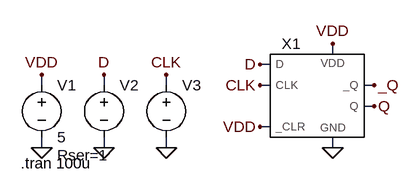
[diagram p0: schematic FFDTB.asc]
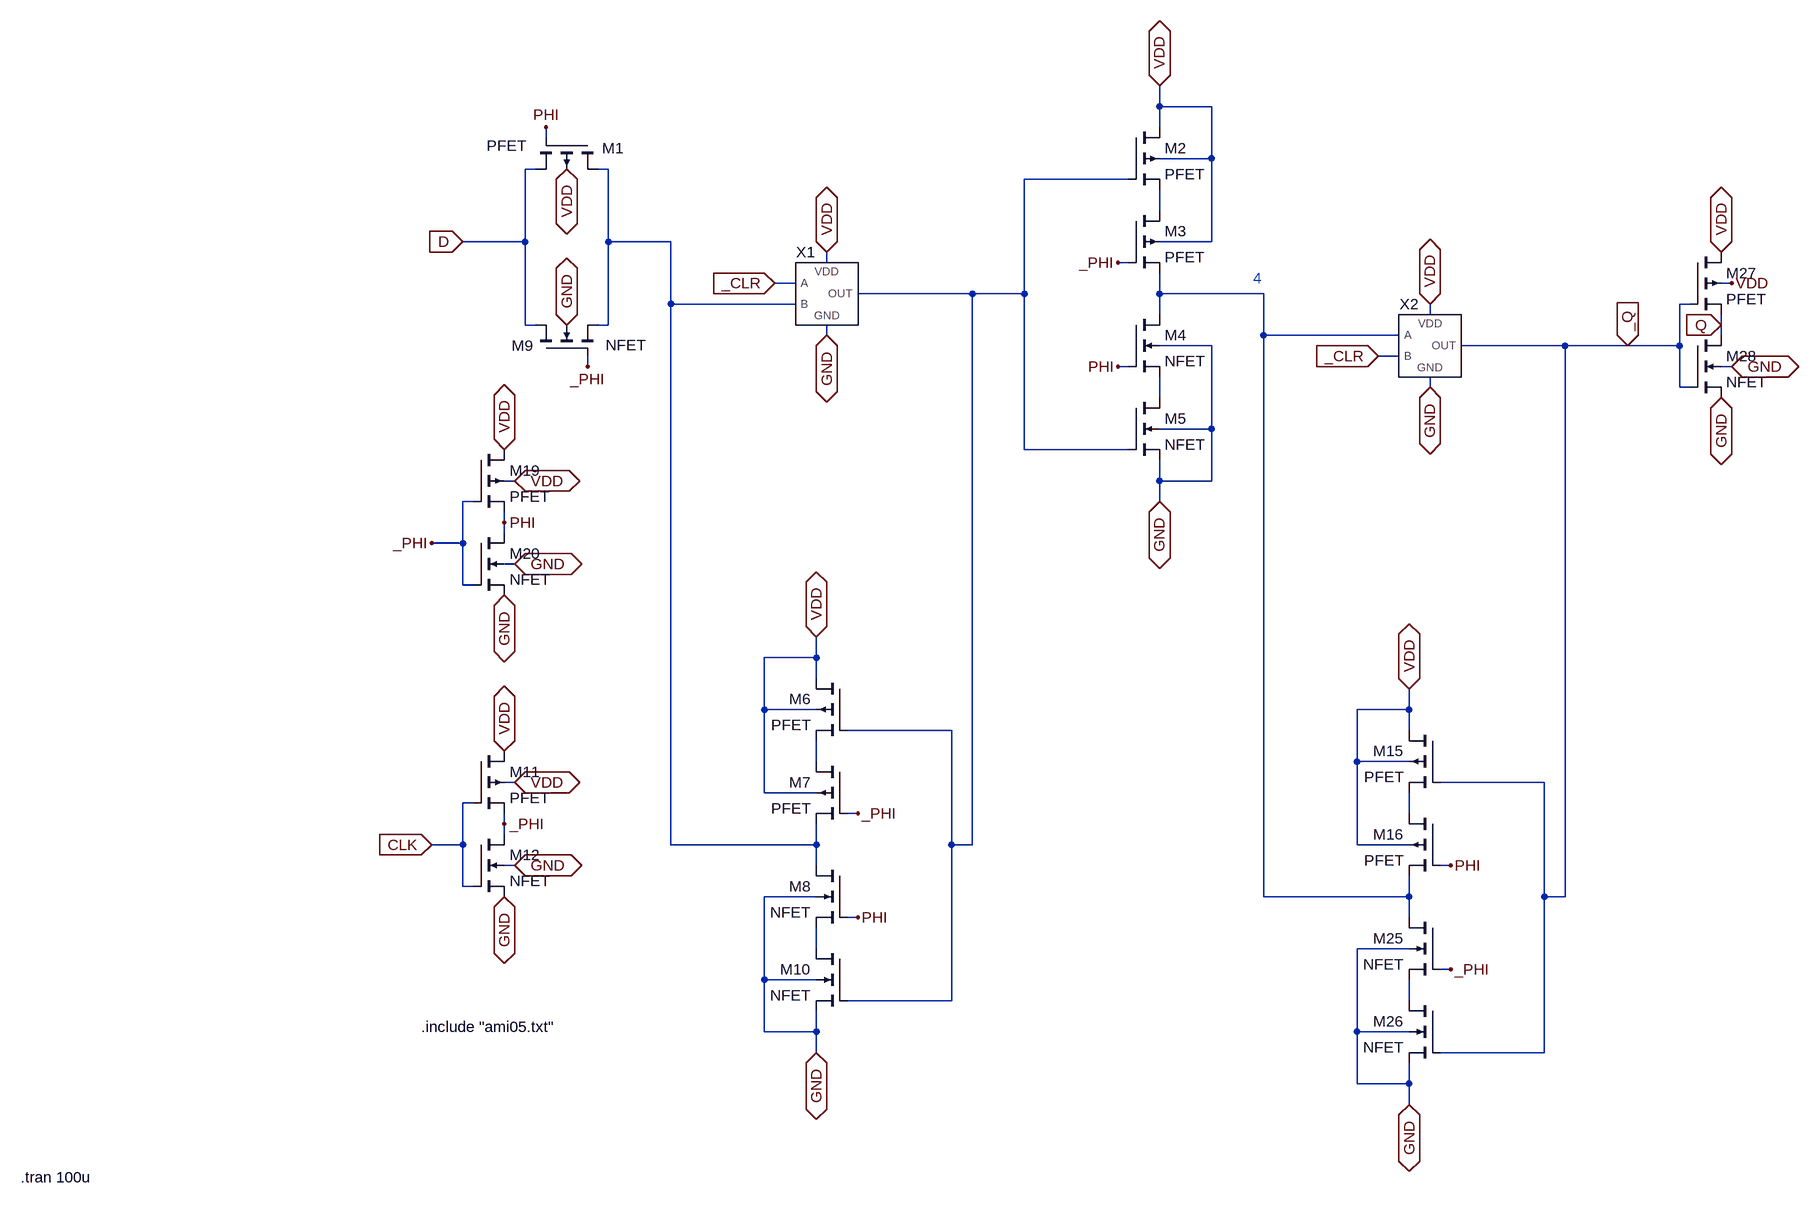
[diagram p1: sub-circuit ffd.asc]
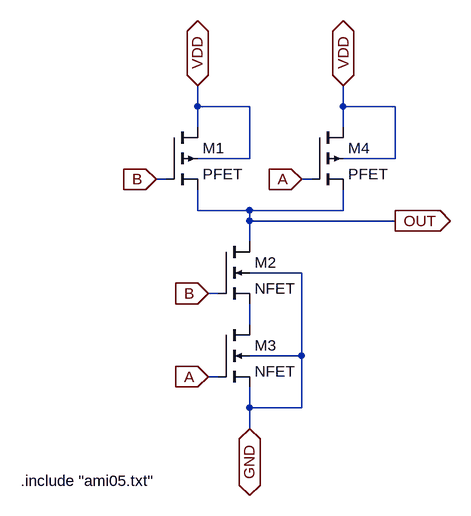
[diagram p2: sub-circuit nand.asc]
FFDTB.asc, the LTspice schematic file:
Version 4
SHEET 1 880 680
WIRE 224 64 224 48
WIRE 128 80 112 80
WIRE -224 112 -224 96
WIRE -128 112 -128 96
WIRE -32 112 -32 96
WIRE 128 112 112 112
WIRE 288 112 272 112
WIRE 288 144 272 144
WIRE 128 176 112 176
WIRE -224 208 -224 192
WIRE -128 208 -128 192
WIRE -32 208 -32 192
WIRE 224 208 224 192
FLAG 224 48 VDD
FLAG 224 208 0
FLAG 288 112 _Q
FLAG 112 80 D
FLAG 112 112 CLK
FLAG -224 208 0
FLAG -128 208 0
FLAG -32 208 0
FLAG -128 96 D
FLAG -32 96 CLK
FLAG -224 96 VDD
FLAG 288 144 Q
FLAG 112 176 VDD
SYMBOL voltage -224 96 R0
WINDOW 123 0 0 Left 0
WINDOW 39 24 124 Left 2
SYMATTR SpiceLine Rser=1
SYMATTR InstName V1
SYMATTR Value 5
SYMBOL voltage -128 96 R0
WINDOW 3 24 96 Invisible 2
WINDOW 123 0 0 Left 0
WINDOW 39 0 0 Left 0
SYMATTR Value PULSE(0 5 3u 1n 1n 10u 20u)
SYMATTR InstName V2
SYMBOL voltage -32 96 R0
WINDOW 3 24 96 Invisible 2
WINDOW 123 0 0 Left 0
WINDOW 39 0 0 Left 0
SYMATTR Value PULSE(0 5 0 1n 1n 5u 10u)
SYMATTR InstName V3
SYMBOL FFD 208 144 R0
SYMATTR InstName X1
TEXT -256 232 Left 2 !.tran 100u

ffd.asc, the sub-circuit schematic file:
Version 4
SHEET 1 2988 1332
WIRE 992 -336 992 -368
WIRE 1072 -336 992 -336
WIRE 992 -304 992 -336
WIRE 48 -288 48 -304
WIRE 1072 -256 1072 -336
WIRE 1072 -256 992 -256
WIRE 32 -240 16 -240
WIRE 144 -240 128 -240
WIRE 944 -224 784 -224
WIRE 992 -176 992 -208
WIRE 16 -128 16 -240
WIRE 16 -128 -80 -128
WIRE 144 -128 144 -240
WIRE 240 -128 144 -128
WIRE 1072 -128 1072 -256
WIRE 1072 -128 992 -128
WIRE 480 -96 480 -112
WIRE 944 -96 928 -96
WIRE 432 -64 400 -64
WIRE 1872 -64 1856 -64
WIRE 704 -48 528 -48
WIRE 784 -48 784 -224
WIRE 784 -48 704 -48
WIRE 992 -48 992 -80
WIRE 1152 -48 992 -48
WIRE 240 -32 240 -128
WIRE 432 -32 240 -32
WIRE 1808 -32 1792 -32
WIRE 992 -16 992 -48
WIRE 1408 -16 1408 -32
WIRE 16 0 16 -128
WIRE 32 0 16 0
WIRE 144 0 144 -128
WIRE 144 0 128 0
WIRE 1856 0 1856 -16
WIRE 480 16 480 0
WIRE 1152 16 1152 -48
WIRE 1360 16 1152 16
WIRE 1856 16 1856 0
WIRE 1072 32 992 32
WIRE 1616 32 1456 32
WIRE 1712 32 1616 32
WIRE 1792 32 1792 -32
WIRE 1792 32 1712 32
WIRE 1360 48 1328 48
WIRE 112 64 112 48
WIRE 944 64 928 64
WIRE 1872 64 1856 64
WIRE 1408 96 1408 80
WIRE 1792 96 1792 32
WIRE 1808 96 1792 96
WIRE 992 112 992 80
WIRE 1072 160 1072 32
WIRE 1072 160 992 160
WIRE 784 192 784 -48
WIRE 944 192 784 192
WIRE 0 240 -16 240
WIRE 992 240 992 208
WIRE 1072 240 1072 160
WIRE 1072 240 992 240
WIRE -64 272 -80 272
WIRE 992 272 992 240
WIRE -16 304 -16 288
WIRE -16 320 -16 304
WIRE -80 336 -80 272
WIRE -80 336 -128 336
WIRE 0 368 -16 368
WIRE -80 400 -80 336
WIRE -64 400 -80 400
WIRE 464 512 464 480
WIRE 464 512 384 512
WIRE 464 544 464 512
WIRE 384 592 384 512
WIRE 464 592 384 592
WIRE 1376 592 1376 560
WIRE 1376 592 1296 592
WIRE 672 624 512 624
WIRE 1376 624 1376 592
WIRE 464 672 464 640
WIRE 1296 672 1296 592
WIRE 1376 672 1296 672
WIRE 0 704 -16 704
WIRE 1584 704 1424 704
WIRE 384 720 384 592
WIRE 464 720 384 720
WIRE -64 736 -80 736
WIRE 528 752 512 752
WIRE 1376 752 1376 720
WIRE -16 768 -16 752
WIRE -16 784 -16 768
WIRE -80 800 -80 736
WIRE -80 800 -128 800
WIRE 240 800 240 -32
WIRE 464 800 464 768
WIRE 464 800 240 800
WIRE 672 800 672 624
WIRE 704 800 704 -48
WIRE 704 800 672 800
WIRE 1296 800 1296 672
WIRE 1376 800 1296 800
WIRE 0 832 -16 832
WIRE 464 832 464 800
WIRE 1440 832 1424 832
WIRE -80 864 -80 800
WIRE -64 864 -80 864
WIRE 464 880 384 880
WIRE 1152 880 1152 16
WIRE 1376 880 1376 848
WIRE 1376 880 1152 880
WIRE 1584 880 1584 704
WIRE 1616 880 1616 32
WIRE 1616 880 1584 880
WIRE 528 912 512 912
WIRE 1376 912 1376 880
WIRE 464 960 464 928
WIRE 1376 960 1296 960
WIRE 1440 992 1424 992
WIRE 384 1008 384 880
WIRE 464 1008 384 1008
WIRE 672 1040 672 800
WIRE 672 1040 512 1040
WIRE 1376 1040 1376 1008
WIRE 384 1088 384 1008
WIRE 464 1088 464 1056
WIRE 464 1088 384 1088
WIRE 1296 1088 1296 960
WIRE 1376 1088 1296 1088
WIRE 464 1120 464 1088
WIRE 1584 1120 1584 880
WIRE 1584 1120 1424 1120
WIRE 1296 1168 1296 1088
WIRE 1376 1168 1376 1136
WIRE 1376 1168 1296 1168
WIRE 1376 1200 1376 1168
FLAG 80 -240 VDD
IOPIN 80 -240 BiDir
FLAG 48 -304 PHI
FLAG 112 64 _PHI
FLAG -80 -128 D
IOPIN -80 -128 In
FLAG 0 704 VDD
IOPIN 0 704 BiDir
FLAG -16 768 _PHI
FLAG -128 800 CLK
IOPIN -128 800 In
FLAG -16 880 GND
IOPIN -16 880 BiDir
FLAG 0 832 GND
IOPIN 0 832 BiDir
FLAG 80 0 GND
IOPIN 80 0 BiDir
FLAG 0 240 VDD
IOPIN 0 240 BiDir
FLAG -16 304 PHI
FLAG -128 336 _PHI
FLAG -16 416 GND
IOPIN -16 416 BiDir
FLAG 0 368 GND
IOPIN 0 368 BiDir
FLAG -16 192 VDD
IOPIN -16 192 BiDir
FLAG -16 656 VDD
IOPIN -16 656 BiDir
FLAG 992 -368 VDD
IOPIN 992 -368 BiDir
FLAG 992 272 GND
IOPIN 992 272 BiDir
FLAG 928 -96 _PHI
FLAG 928 64 PHI
FLAG 464 480 VDD
IOPIN 464 480 BiDir
FLAG 464 1120 GND
IOPIN 464 1120 BiDir
FLAG 528 752 _PHI
FLAG 528 912 PHI
FLAG 1376 560 VDD
IOPIN 1376 560 BiDir
FLAG 1376 1200 GND
IOPIN 1376 1200 BiDir
FLAG 1440 832 PHI
FLAG 1440 992 _PHI
FLAG 1872 -64 VDD
FLAG 1856 0 Q
IOPIN 1856 0 In
FLAG 1856 112 GND
IOPIN 1856 112 BiDir
FLAG 1872 64 GND
IOPIN 1872 64 BiDir
FLAG 1856 -112 VDD
IOPIN 1856 -112 BiDir
FLAG 1712 32 _Q
IOPIN 1712 32 In
FLAG 480 16 GND
IOPIN 480 16 BiDir
FLAG 1408 96 GND
IOPIN 1408 96 BiDir
FLAG 1408 -32 VDD
IOPIN 1408 -32 BiDir
FLAG 480 -112 VDD
IOPIN 480 -112 BiDir
FLAG 400 -64 _CLR
IOPIN 400 -64 In
FLAG 1328 48 _CLR
IOPIN 1328 48 In
SYMBOL pmos4 128 -288 R90
WINDOW 0 16 -40 VRight 2
WINDOW 3 12 110 VRight 2
SYMATTR InstName M1
SYMATTR Value PFET
SYMATTR Value2 l=600n w=6u
SYMBOL nmos4 32 48 R270
WINDOW 0 16 -37 VRight 2
WINDOW 3 17 108 VRight 2
SYMATTR InstName M9
SYMATTR Value NFET
SYMATTR Value2 l=600n w=3u
SYMBOL pmos4 -64 192 R0
SYMATTR InstName M19
SYMATTR Value2 l=600n w=3u
SYMATTR Value PFET
SYMBOL nmos4 -64 320 R0
SYMATTR InstName M20
SYMATTR Value2 l=600n w=1.5u
SYMATTR Value NFET
SYMBOL pmos4 944 -304 R0
SYMATTR InstName M2
SYMATTR Value2 l=600n w=6u
SYMATTR Value PFET
SYMBOL pmos4 944 -176 R0
SYMATTR InstName M3
SYMATTR Value2 l=600n w=6u
SYMATTR Value PFET
SYMBOL nmos4 944 -16 R0
SYMATTR InstName M4
SYMATTR Value2 l=600n w=3u
SYMATTR Value NFET
SYMBOL nmos4 944 112 R0
SYMATTR InstName M5
SYMATTR Value2 l=600n w=3u
SYMATTR Value NFET
SYMBOL pmos4 512 544 M0
SYMATTR InstName M6
SYMATTR Value2 l=600n w=6u
SYMATTR Value PFET
SYMBOL pmos4 512 672 M0
SYMATTR InstName M7
SYMATTR Value2 l=600n w=6u
SYMATTR Value PFET
SYMBOL nmos4 512 832 M0
SYMATTR InstName M8
SYMATTR Value2 l=600n w=3u
SYMATTR Value NFET
SYMBOL nmos4 512 960 M0
SYMATTR InstName M10
SYMATTR Value2 l=600n w=3u
SYMATTR Value NFET
SYMBOL pmos4 1424 624 M0
SYMATTR InstName M15
SYMATTR Value2 l=600n w=6u
SYMATTR Value PFET
SYMBOL pmos4 1424 752 M0
SYMATTR InstName M16
SYMATTR Value2 l=600n w=6u
SYMATTR Value PFET
SYMBOL nmos4 1424 912 M0
SYMATTR InstName M25
SYMATTR Value2 l=600n w=3u
SYMATTR Value NFET
SYMBOL nmos4 1424 1040 M0
SYMATTR InstName M26
SYMATTR Value2 l=600n w=3u
SYMATTR Value NFET
SYMBOL pmos4 1808 -112 R0
SYMATTR InstName M27
SYMATTR Value2 l=600n w=3u
SYMATTR Value PFET
SYMBOL nmos4 1808 16 R0
SYMATTR InstName M28
SYMATTR Value2 l=600n w=1.5u
SYMATTR Value NFET
SYMBOL NAND 480 -48 R0
SYMATTR InstName X1
SYMBOL NAND 1408 32 R0
SYMATTR InstName X2
SYMBOL pmos4 -64 656 R0
SYMATTR InstName M11
SYMATTR Value2 l=600n w=3u
SYMATTR Value PFET
SYMBOL nmos4 -64 784 R0
SYMATTR InstName M12
SYMATTR Value2 l=600n w=1.5u
SYMATTR Value NFET
TEXT -144 1080 Left 2 !.include "ami05.txt"
TEXT -760 1312 Left 2 !.tran 100u
TEXT 1136 -72 Left 2 ;4

nand.asc, the sub-circuit schematic file:
Version 4
SHEET 1 880 680
WIRE 32 -96 32 -128
WIRE 112 -96 32 -96
WIRE 256 -96 256 -128
WIRE 336 -96 256 -96
WIRE 32 -64 32 -96
WIRE 256 -64 256 -96
WIRE 112 -16 112 -96
WIRE 112 -16 32 -16
WIRE 336 -16 336 -96
WIRE 336 -16 256 -16
WIRE -16 16 -32 16
WIRE 208 16 192 16
WIRE 32 64 32 32
WIRE 112 64 32 64
WIRE 256 64 256 32
WIRE 256 64 112 64
WIRE 112 80 112 64
WIRE 336 80 112 80
WIRE 112 112 112 80
WIRE 192 160 112 160
WIRE 64 192 48 192
WIRE 112 240 112 208
WIRE 192 288 192 160
WIRE 192 288 112 288
WIRE 64 320 48 320
WIRE 112 368 112 336
WIRE 192 368 192 288
WIRE 192 368 112 368
WIRE 112 400 112 368
FLAG 112 400 GND
IOPIN 112 400 BiDir
FLAG 32 -128 VDD
IOPIN 32 -128 BiDir
FLAG 256 -128 VDD
IOPIN 256 -128 BiDir
FLAG 192 16 A
IOPIN 192 16 In
FLAG 48 320 A
IOPIN 48 320 In
FLAG 48 192 B
IOPIN 48 192 In
FLAG -32 16 B
IOPIN -32 16 In
FLAG 336 80 OUT
IOPIN 336 80 Out
SYMBOL pmos4 -16 -64 R0
SYMATTR InstName M1
SYMATTR Value2 l=600n w=3u
SYMATTR Value PFET
SYMBOL nmos4 64 112 R0
SYMATTR InstName M2
SYMATTR Value2 l=600n w=3u
SYMATTR Value NFET
SYMBOL nmos4 64 240 R0
SYMATTR InstName M3
SYMATTR Value2 l=600n w=3u
SYMATTR Value NFET
SYMBOL pmos4 208 -64 R0
SYMATTR InstName M4
SYMATTR Value2 l=600n w=3u
SYMATTR Value PFET
TEXT -240 480 Left 2 !.include "ami05.txt"

The netlist it stands for:
* FFDTB.asc
V1 VDD 0 5 Rser=1
V2 D 0 PULSE(0 5 3u 1n 1n 10u 20u)
V3 CLK 0 PULSE(0 5 0 1n 1n 5u 10u)
XX1 VDD CLK D Q _Q 0 VDD ffd

* block symbol definitions
.subckt ffd _CLR CLK D Q _Q GND VDD
M1 N001 PHI D VDD PFET l=600n w=6u
M9 D _PHI N001 GND NFET l=600n w=3u
M19 VDD _PHI PHI VDD PFET l=600n w=3u
M20 PHI _PHI GND GND NFET l=600n w=1.5u
M2 VDD N002 N003 VDD PFET l=600n w=6u
M3 N003 _PHI N004 VDD PFET l=600n w=6u
M4 N004 PHI N005 GND NFET l=600n w=3u
M5 N005 N002 GND GND NFET l=600n w=3u
M6 VDD N002 N006 VDD PFET l=600n w=6u
M7 N006 _PHI N001 VDD PFET l=600n w=6u
M8 N001 PHI N008 GND NFET l=600n w=3u
M10 N008 N002 GND GND NFET l=600n w=3u
M15 VDD _Q N007 VDD PFET l=600n w=6u
M16 N007 PHI N004 VDD PFET l=600n w=6u
M25 N004 _PHI N009 GND NFET l=600n w=3u
M26 N009 _Q GND GND NFET l=600n w=3u
M27 VDD _Q Q VDD PFET l=600n w=3u
M28 Q _Q GND GND NFET l=600n w=1.5u
XX1 _CLR N001 GND N002 VDD nand
XX2 N004 _CLR GND _Q VDD nand
M11 VDD CLK _PHI VDD PFET l=600n w=3u
M12 _PHI CLK GND GND NFET l=600n w=1.5u
.include "ami05.txt"
.tran 100u
* 4
.ends ffd

.subckt nand A B GND OUT VDD
M1 VDD B OUT VDD PFET l=600n w=3u
M2 OUT B N001 GND NFET l=600n w=3u
M3 N001 A GND GND NFET l=600n w=3u
M4 VDD A OUT VDD PFET l=600n w=3u
.include "ami05.txt"
.ends nand

.model NMOS NMOS
.model PMOS PMOS
.lib standard.mos
.tran 100u
.backanno
.end